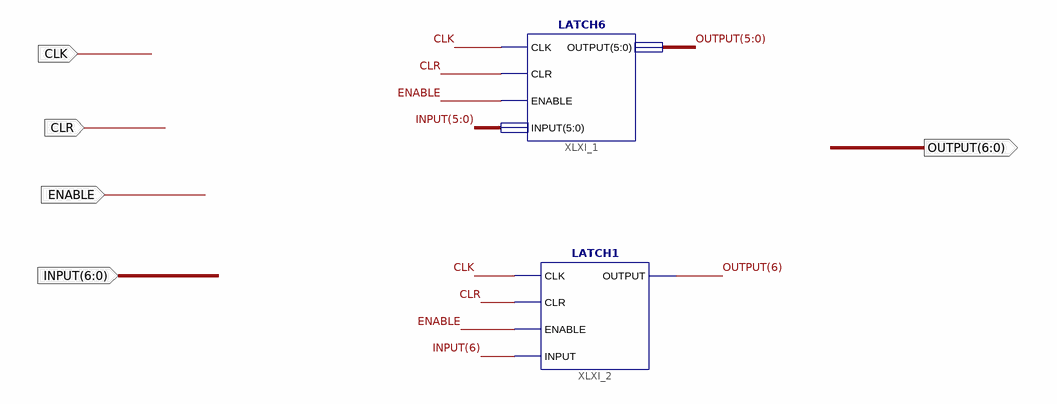
[diagram p0: schematic sheet 1]
// Xilinx ISE schematic LATCH7.sch (artix7) as structural Verilog: 2 symbols, 5 ports
module LATCH7 (
  input  CLK,
  input  CLR,
  input  ENABLE,
  input  [6:0] INPUT,
  output [6:0] OUTPUT
);

  LATCH6 XLXI_1 (.CLK(CLK), .CLR(CLR), .ENABLE(ENABLE), .INPUT(INPUT[5:0]), .OUTPUT(OUTPUT[5:0]));
  LATCH1 XLXI_2 (.CLK(CLK), .CLR(CLR), .ENABLE(ENABLE), .INPUT(INPUT[6]), .OUTPUT(OUTPUT[6]));
endmodule
